# Altium schematic sheet tof_sideXtal_timing.SchDoc
size A4
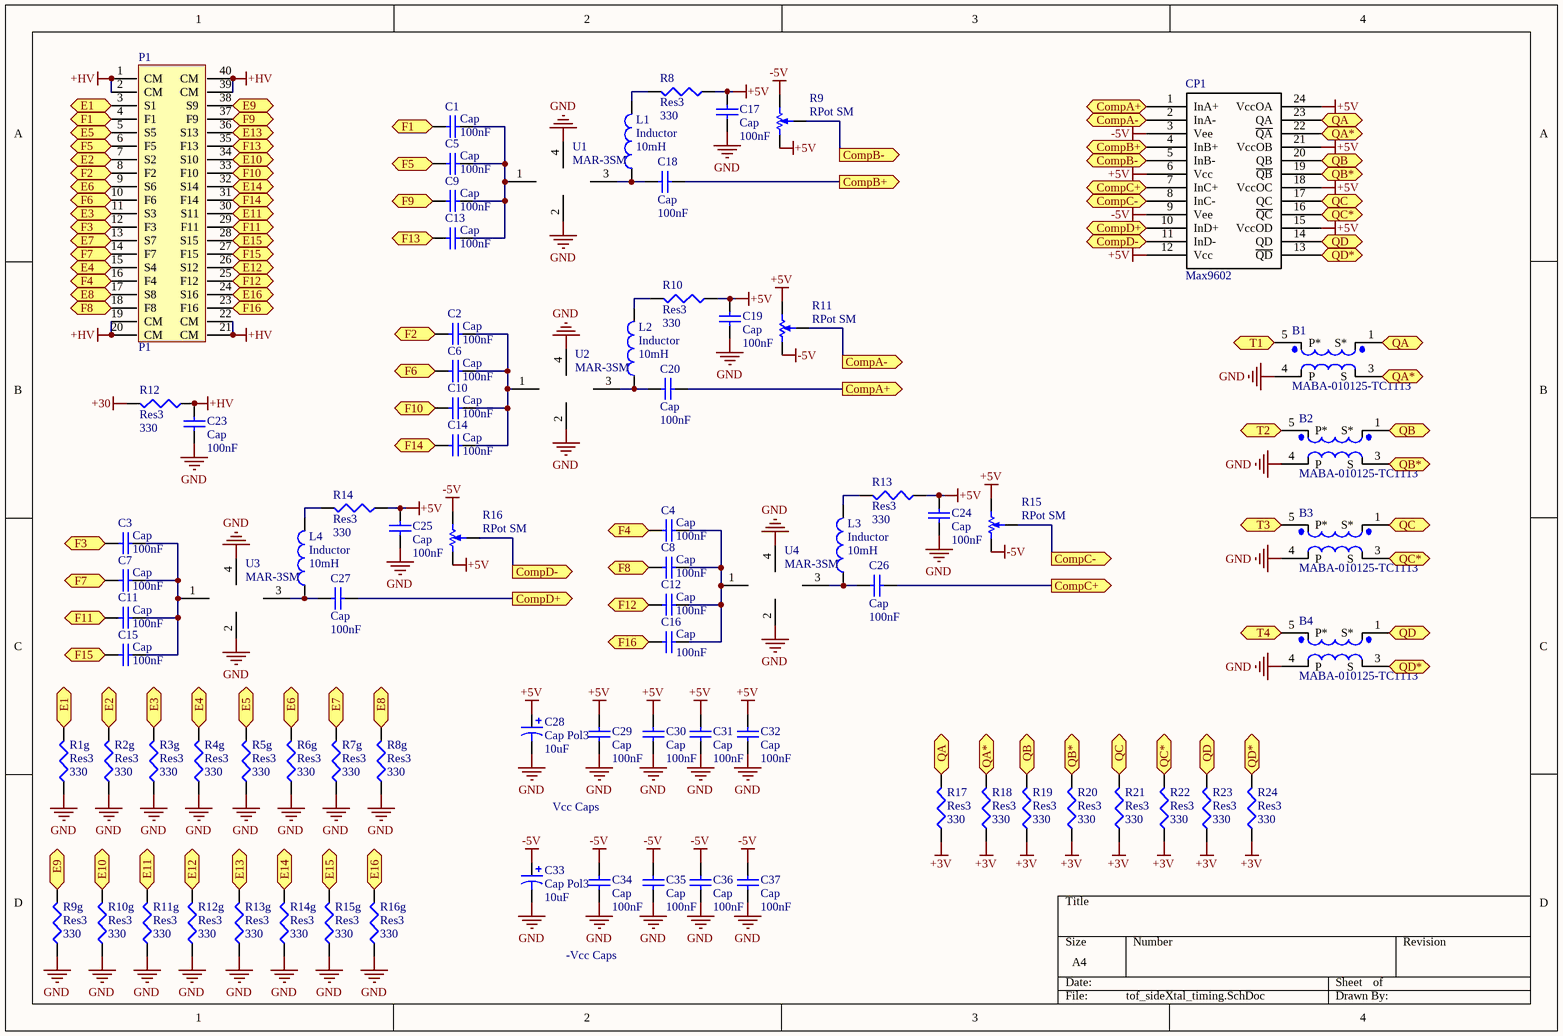
[diagram p0: tof_sideXtal_timing.SchDoc]

## Parts
B1  MABA-010125-TC1113  [SM-22]
B2  MABA-010125-TC1113  [SM-22]
B3  MABA-010125-TC1113  [SM-22]
B4  MABA-010125-TC1113  [SM-22]
C1  Cap  value 100nF  [J1-0603]
C2  Cap  value 100nF  [J1-0603]
C3  Cap  value 100nF  [J1-0603]
C4  Cap  value 100nF  [J1-0603]
C5  Cap  value 100nF  [J1-0603]
C6  Cap  value 100nF  [J1-0603]
C7  Cap  value 100nF  [J1-0603]
C8  Cap  value 100nF  [J1-0603]
C9  Cap  value 100nF  [J1-0603]
C10  Cap  value 100nF  [J1-0603]
C11  Cap  value 100nF  [J1-0603]
C12  Cap  value 100nF  [J1-0603]
C13  Cap  value 100nF  [J1-0603]
C14  Cap  value 100nF  [J1-0603]
C15  Cap  value 100nF  [J1-0603]
C16  Cap  value 100nF  [J1-0603]
C17  Cap  value 100nF  [J1-0603]
C18  Cap  value 100nF  [J1-0603]
C19  Cap  value 100nF  [J1-0603]
C20  Cap  value 100nF  [J1-0603]
C23  Cap  value 100nF  [J1-0603]
C24  Cap  value 100nF  [J1-0603]
C25  Cap  value 100nF  [J1-0603]
C26  Cap  value 100nF  [J1-0603]
C27  Cap  value 100nF  [J1-0603]
C28  Cap Pol3  value 10uF  [J1-0603]
C29  Cap  value 100nF  [0402]
C30  Cap  value 100nF  [0402]
C31  Cap  value 100nF  [0402]
C32  Cap  value 100nF  [0402]
C33  Cap Pol3  value 10uF  [J1-0603]
C34  Cap  value 100nF  [0402]
C35  Cap  value 100nF  [0402]
C36  Cap  value 100nF  [0402]
C37  Cap  value 100nF  [0402]
CP1  Max9602  [TSSOP24]
L1  Inductor  value 10mH  [J1-0603]
L2  Inductor  value 10mH  [J1-0603]
L3  Inductor  value 10mH  [J1-0603]
L4  Inductor  value 10mH  [J1-0603]
P1  P1  [DS17(3.0)-40DS-0.5(0.57)]
R1g  Res3  value 330  [0402]
R2g  Res3  value 330  [0402]
R3g  Res3  value 330  [0402]
R4g  Res3  value 330  [0402]
R5g  Res3  value 330  [0402]
R6g  Res3  value 330  [0402]
R7g  Res3  value 330  [0402]
R8  Res3  value 330  [J1-0603]
R8g  Res3  value 330  [0402]
R9  RPot SM  [POT-3MM-SMD]
R9g  Res3  value 330  [0402]
R10  Res3  value 330  [J1-0603]
R10g  Res3  value 330  [0402]
R11  RPot SM  [POT-3MM-SMD]
R11g  Res3  value 330  [0402]
R12  Res3  value 330  [0402]
R12g  Res3  value 330  [0402]
R13  Res3  value 330  [J1-0603]
R13g  Res3  value 330  [0402]
R14  Res3  value 330  [J1-0603]
R14g  Res3  value 330  [0402]
R15  RPot SM  [POT-3MM-SMD]
R15g  Res3  value 330  [0402]
R16  RPot SM  [POT-3MM-SMD]
R16g  Res3  value 330  [0402]
R17  Res3  value 330  [0402]
R18  Res3  value 330  [0402]
R19  Res3  value 330  [0402]
R20  Res3  value 330  [0402]
R21  Res3  value 330  [0402]
R22  Res3  value 330  [0402]
R23  Res3  value 330  [0402]
R24  Res3  value 330  [0402]
U1  MAR-3SM  [WW107]
U2  MAR-3SM  [WW107]
U3  MAR-3SM  [WW107]
U4  MAR-3SM  [WW107]

## Ports
CompA+ (out), CompA- (out), CompB+ (out), CompB- (out), CompC+ (out), CompC- (out), CompD+ (out), CompD- (out), E1 (out), E2 (out), E3 (out), E4 (out), E5 (out), E6 (out), E7 (out), E8 (out), E9 (out), E10 (out), E11 (out), E12 (out), E13 (out), E14 (out), E15 (out), E16 (out), F1 (out), F2 (out), F3 (out), F4 (out), F5 (out), F6 (out), F7 (out), F8 (out), F9 (out), F10 (out), F11 (out), F12 (out), F13 (out), F14 (out), F15 (out), F16 (out), QA (out), QA* (out), QB (out), QB* (out), QC (out), QC* (out), QD (out), QD* (out), T1 (out), T2 (out), T3 (out), T4 (out)

## Nets
+3V: R17.1 R18.1 R19.1 R20.1 R21.1 R22.1 R23.1 R24.1
+5V: C17.1 C19.1 C24.1 C25.1 C28.1 C29.2 C30.2 C31.2 C32.2 CP1.6(Vcc) CP1.12(Vcc) CP1.15(VccOD) CP1.18(VccOC) CP1.21(VccOB) CP1.24(VccOA) R8.1 R9.CCW(-) R10.1 R11.CW(+) R13.1 R14.1 R15.CW(+) R16.CCW(-)
+30: R12.2
+HV: C23.1 P1.1(CM) P1.2(CM) P1.19(CM) P1.20(CM) P1.21(CM) P1.22(CM) P1.39(CM) P1.40(CM) R12.1
-5V: C33.1 C34.2 C35.2 C36.2 C37.2 CP1.3(Vee) CP1.9(Vee) R9.CW(+) R11.CCW(-) R15.CCW(-) R16.CW(+)
GND: B1.4(P) B2.4(P) B3.4(P) B4.4(P) C17.2 C19.2 C23.2 C24.2 C25.2 C28.2 C29.1 C30.1 C31.1 C32.1 C33.2 C34.1 C35.1 C36.1 C37.1 R1g.1 R2g.1 R3g.1 R4g.1 R5g.1 R6g.1 R7g.1 R8g.1 R9g.1 R10g.1 R11g.1 R12g.1 R13g.1 R14g.1 R15g.1 R16g.1 U1.2 U1.4 U2.2 U2.4 U3.2 U3.4 U4.2 U4.4
CompA+: C20.2 CP1.1(InA+) ; port CompA+
CompA-: CP1.2(InA-) R11.W ; port CompA-
CompB+: C18.2 CP1.4(InB+) ; port CompB+
CompB-: CP1.5(InB-) R9.W ; port CompB-
CompC+: C26.2 CP1.7(InC+) ; port CompC+
CompC-: CP1.8(InC-) R15.W ; port CompC-
CompD+: C27.2 CP1.10(InD+) ; port CompD+
CompD-: CP1.11(InD-) R16.W ; port CompD-
E1: P1.3(S1) R1g.2 ; port E1
E2: P1.7(S2) R2g.2 ; port E2
E3: P1.11(S3) R3g.2 ; port E3
E4: P1.15(S4) R4g.2 ; port E4
E5: P1.5(S5) R5g.2 ; port E5
E6: P1.9(S6) R6g.2 ; port E6
E7: P1.13(S7) R7g.2 ; port E7
E8: P1.17(S8) R8g.2 ; port E8
E9: P1.38(S9) R9g.2 ; port E9
E10: P1.34(S10) R10g.2 ; port E10
E11: P1.30(S11) R11g.2 ; port E11
E12: P1.26(S12) R12g.2 ; port E12
E13: P1.36(S13) R13g.2 ; port E13
E14: P1.32(S14) R14g.2 ; port E14
E15: P1.28(S15) R15g.2 ; port E15
E16: P1.24(S16) R16g.2 ; port E16
F1: C1.2 P1.4(F1) ; port F1
F2: C2.2 P1.8(F2) ; port F2
F3: C3.2 P1.12(F3) ; port F3
F4: C4.2 P1.16(F4) ; port F4
F5: C5.2 P1.6(F5) ; port F5
F6: C6.2 P1.10(F6) ; port F6
F7: C7.2 P1.14(F7) ; port F7
F8: C8.2 P1.18(F8) ; port F8
F9: C9.2 P1.37(F9) ; port F9
F10: C10.2 P1.33(F10) ; port F10
F11: C11.2 P1.29(F11) ; port F11
F12: C12.2 P1.25(F12) ; port F12
F13: C13.2 P1.35(F13) ; port F13
F14: C14.2 P1.31(F14) ; port F14
F15: C15.2 P1.27(F15) ; port F15
F16: C16.2 P1.23(F16) ; port F16
QA: B1.1(S*) CP1.23(QA) R17.2 ; port QA
QA*: B1.3(S) CP1.22(~{QA}) R18.2 ; port QA*
QB: B2.1(S*) CP1.20(QB) R19.2 ; port QB
QB*: B2.3(S) CP1.19(~{QB}) R20.2 ; port QB*
QC: B3.1(S*) CP1.17(QC) R21.2 ; port QC
QC*: B3.3(S) CP1.16(~{QC}) R22.2 ; port QC*
QD: B4.1(S*) CP1.14(QD) R23.2 ; port QD
QD*: B4.3(S) CP1.13(~{QD}) R24.2 ; port QD*
T1: B1.5(P*) ; port T1
T2: B2.5(P*) ; port T2
T3: B3.5(P*) ; port T3
T4: B4.5(P*) ; port T4
NetC1_1: C1.1 C5.1 C9.1 C13.1 U1.1
NetC2_1: C2.1 C6.1 C10.1 C14.1 U2.1
NetC3_1: C3.1 C7.1 C11.1 C15.1 U3.1
NetC4_1: C4.1 C8.1 C12.1 C16.1 U4.1
NetC18_1: C18.1 L1.1 U1.3
NetC20_1: C20.1 L2.1 U2.3
NetC26_1: C26.1 L3.1 U4.3
NetC27_1: C27.1 L4.1 U3.3
NetL1_2: L1.2 R8.2
NetL2_2: L2.2 R10.2
NetL3_2: L3.2 R13.2
NetL4_2: L4.2 R14.2

## Notes on the sheet
- Vcc Caps
- -Vcc Caps

## Library data of the parts
C1-C20 C23-C27 C29-C32 C34-C37 = Cap: Capacitor; Published: 8-Jun-2000; LatestRevisionDate: 17-Jul-2002; LatestRevisionNote: Re-released for DXP Platform.; PackageReference: RAD-0.3; Publisher: Altium Limited; PackageDescription: Radial Cap, Thru-Hole; 2 Leads; 0.3 in Pin Spacing
C28 C33 = Cap Pol3: Polarized Capacitor (Surface Mount); Published: 8-Jun-2000; LatestRevisionDate: 29-May-2009; LatestRevisionNote: IPC-7351 Footprint Added.; PackageReference: C0805; Publisher: Altium Limited; PackageDescription: Chip Capacitor
L1-L4 = Inductor: Code_IEC: 1005; Published: 8-Jun-2000; LatestRevisionDate: 29-May-2009; LatestRevisionNote: IPC-7351 Footprint Added.; PackageReference: 0402-A; Publisher: Altium Limited; PackageDescription: Chip Inductor; Code_JEITA: 0402
P1 = Sensl-ArrayC-30035-16P-PCB
R1g R2g R3g R4g R5g R6g R7g R8 R8g R9g R10 R10g R11g R12 R12g R13 R13g R14 R14g R15g R16g R17-R24 = Res3: Resistor; Published: 8-Jun-2000; LatestRevisionDate: 29-May-2009; LatestRevisionNote: IPC-7351 Footprint Added.; PackageReference: J1-0603; Publisher: Altium Limited; PackageDescription: Chip Resistor
R9 R11 R15 R16 = RPot SM: Square Trimming Potentiometer; Published: 17-Dec-2003; DatasheetVersion: Oct-2003; PackageReference: POT4MM-2; Publisher: Altium Limited; PackageDescription: Square Trimming Potentiometer; ComponentLink1Description: Manufacturer Link; ComponentLink1URL: http://bourns.com/2/search.html
U1-U4 = MAR-3SM+